# Altium schematic sheet Photoresistors.SchDoc
size Letter
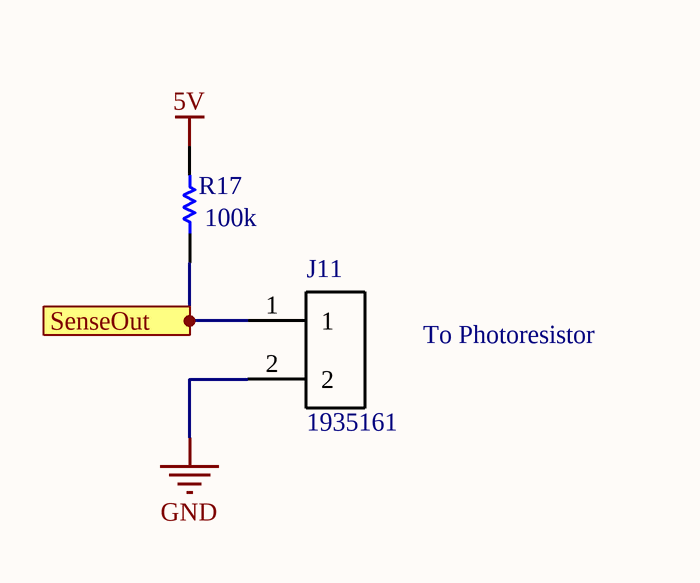
[diagram p0: Photoresistors.SchDoc]

## Parts
J11  1935161  [PHOENIX_1935161]
R17  value 100k  [AXIAL-0.3]  (hidden comment: Res1)

## Ports
SenseOut (out)

## Nets
5V: R17.2
GND: J11.2
SenseOut: J11.1 R17.1 ; port SenseOut

## Notes on the sheet
- To Photoresistor
- Title
- Size:
- Date:
- Letter
- Number:
- Time:
- Revision:
- Sheet
- of
- File:

## Library data of the parts
J11 = 1935161: Conn Terminal Blocks 2 POS 5mm Solder ST Thru-Hole 16A; MF: Phoenix Contact; Digi-Key_Part_Number: 277-1667-ND; Package: None; SnapEDA_Link: https://www.snapeda.com/parts/1935161/Phoenix%20Contact/view-part/?ref=snap; MP: 1935161; Digi-Key_Purchase_URL: https://www.digikey.com/product-detail/en/phoenix-contact/1935161/277-1667-ND/568614?utm_source=snapeda&utm_medium=aggregator&utm_campaign=symbol; Value: *
R17 = Res1: Resistor; Published: 8-Jun-2000; LatestRevisionDate: 17-Jul-2002; LatestRevisionNote: Re-released for DXP Platform.; PackageReference: AXIAL-0.3; Publisher: Altium Limited